# Altium schematic sheet Peripherals.SchDoc
size A4; SheetNumber: 3; SheetTotal: 3
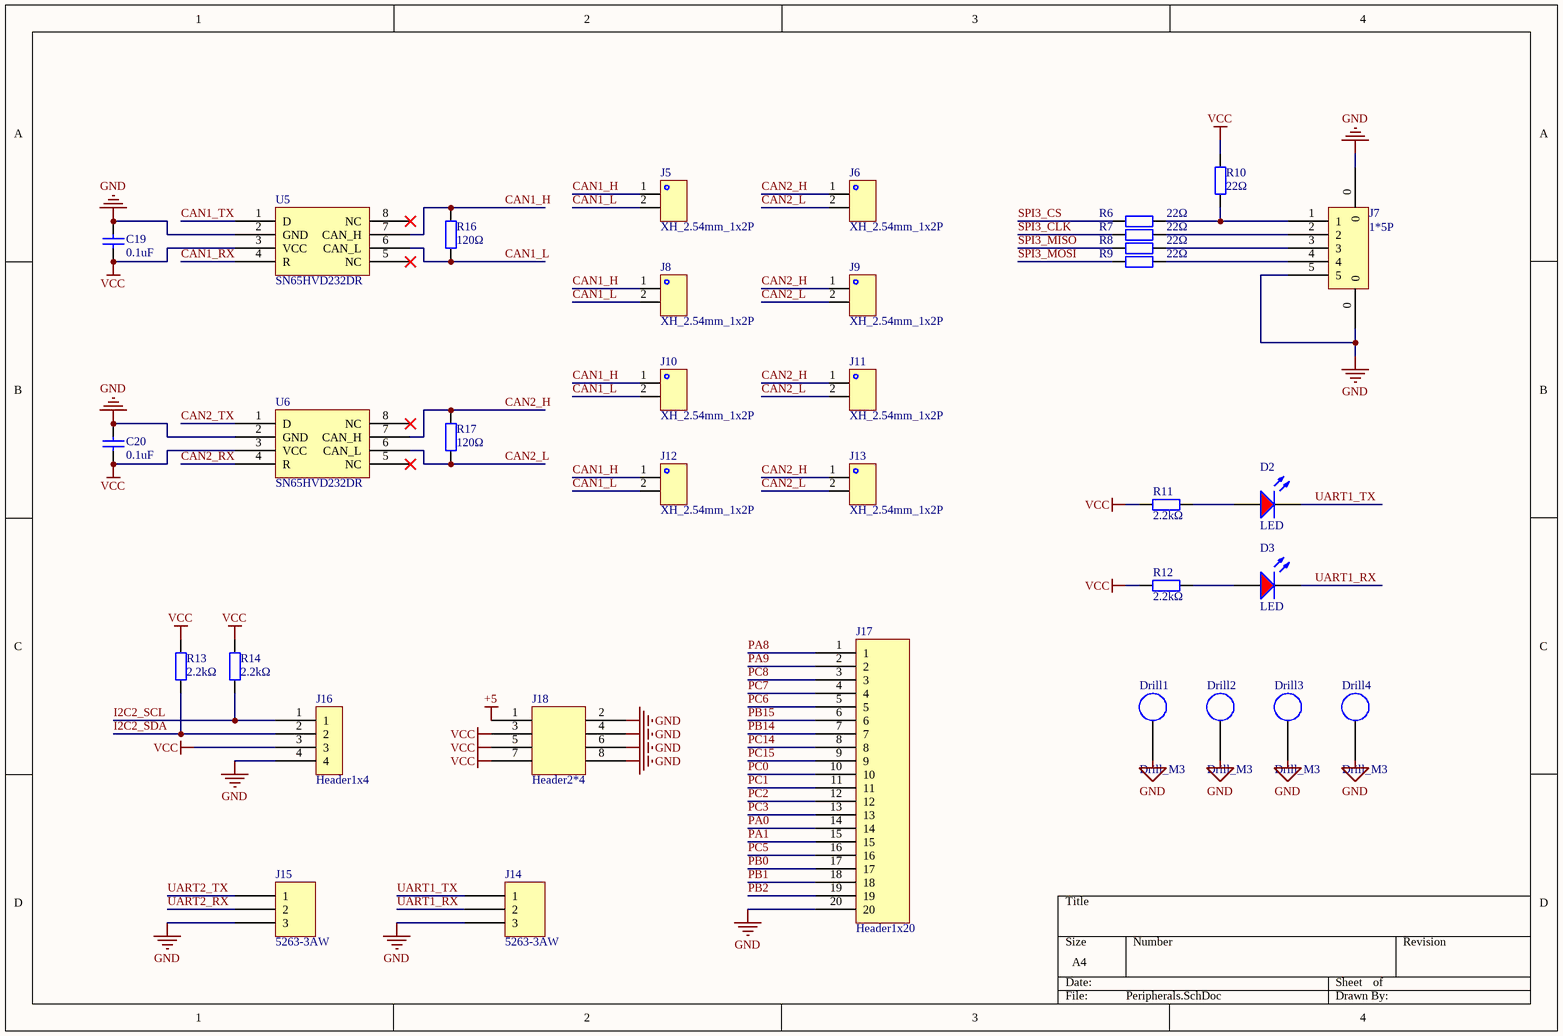
[diagram p0: Peripherals.SchDoc]

## Parts
C19  0.1uF  [C0603]
C20  0.1uF  [C0603]
D2  LED  [0603_LED_S1]
D3  LED  [0603_LED_S1]
Drill1  Drill_M3  [Drill_M_3]
Drill2  Drill_M3  [Drill_M_3]
Drill3  Drill_M3  [Drill_M_3]
Drill4  Drill_M3  [Drill_M_3]
J5  XH_2.54mm_1x2P  [XH2.54mm1x2P弯插]
J6  XH_2.54mm_1x2P  [XH2.54mm1x2P弯插]
J7  1*5P  [1.0T-5P]
J8  XH_2.54mm_1x2P  [XH2.54mm1x2P弯插]
J9  XH_2.54mm_1x2P  [XH2.54mm1x2P弯插]
J10  XH_2.54mm_1x2P  [XH2.54mm1x2P弯插]
J11  XH_2.54mm_1x2P  [XH2.54mm1x2P弯插]
J12  XH_2.54mm_1x2P  [XH2.54mm1x2P弯插]
J13  XH_2.54mm_1x2P  [XH2.54mm1x2P弯插]
J14  5263-3AW  [5264-3AW]
J15  5263-3AW  [5264-3AW]
J16  Header1x4  [Header 1x4p]
J17  Header1x20  [Header1x20]
J18  Header2*4  [Header2*4]
R6  22Ω  [R0603]
R7  22Ω  [R0603]
R8  22Ω  [R0603]
R9  22Ω  [R0603]
R10  22Ω  [R0603]
R11  2.2kΩ  [R0603]
R12  2.2kΩ  [R0603]
R13  2.2kΩ  [R0603]
R14  2.2kΩ  [R0603]
R16  120Ω  [R0603]
R17  120Ω  [R0603]
U5  SN65HVD232DR  [SOIC-8_150mil]
U6  SN65HVD232DR  [SOIC-8_150mil]

## Nets
+5: J18.1(A)
GND: C19.2 C20.2 Drill1.0(A) Drill2.0(A) Drill3.0(A) Drill4.0(A) J7.0 J7.5 J14.3 J15.3 J16.4 J17.20 J18.2(A) J18.4(A) J18.6(A) J18.8(A) U5.2(GND) U6.2(GND)
VCC: C19.1 C20.1 J16.3 J18.3(A) J18.5(A) J18.7(A) R10.2 R11.1 R12.1 R13.2 R14.2 U5.3(VCC) U6.3(VCC)
CAN1_H: J5.1 J8.1 J10.1 J12.1 R16.1 U5.7(CAN_H)
CAN1_L: J5.2 J8.2 J10.2 J12.2 R16.2 U5.6(CAN_L)
CAN1_RX: U5.4(R)
CAN1_TX: U5.1(D)
CAN2_H: J6.1 J9.1 J11.1 J13.1 R17.1 U6.7(CAN_H)
CAN2_L: J6.2 J9.2 J11.2 J13.2 R17.2 U6.6(CAN_L)
CAN2_RX: U6.4(R)
CAN2_TX: U6.1(D)
I2C2_SCL: J16.1 R14.1
I2C2_SDA: J16.2 R13.1
PA0: J17.14
PA1: J17.15
PA8: J17.1
PA9: J17.2
PB0: J17.17
PB1: J17.18
PB2: J17.19
PB14: J17.7
PB15: J17.6
PC0: J17.10
PC1: J17.11
PC2: J17.12
PC3: J17.13
PC5: J17.16
PC6: J17.5
PC7: J17.4
PC8: J17.3
PC14: J17.8
PC15: J17.9
SPI3_CLK: R7.2
SPI3_CS: R6.2
SPI3_MISO: R8.2
SPI3_MOSI: R9.2
UART1_RX: D3.K J14.2
UART1_TX: D2.K J14.1
UART2_RX: J15.2
UART2_TX: J15.1
NetD2_A: D2.A R11.2
NetD3_A: D3.A R12.2
NetJ7_1: J7.1 R6.1 R10.1
NetJ7_2: J7.2 R7.1
NetJ7_3: J7.3 R8.1
NetJ7_4: J7.4 R9.1

Not connected (* = marked no-connect by the designer): U5 5(NC)* 8(NC)*; U6 5(NC)* 8(NC)*

## Library data of the parts
C19 C20 = Capacitor
D2 D3 = 0603 红灯: 发光二极管; ComponentLink1Description: 供应商链接; ComponentLink1URL: http://www.szlcsc.com/product/details_2659.html; Package: 0603; Supplier: LC; SuppliersPartNumber: C2286
J7 = 插座 1*5P 卧贴: C145957
J18 = Header2*4: C124386
R6-R14 R16 R17 = Resistor
U5 U6 = SN65HVD232DR: C30530